# EAGLE design panel (EAGLE 7.2.0)
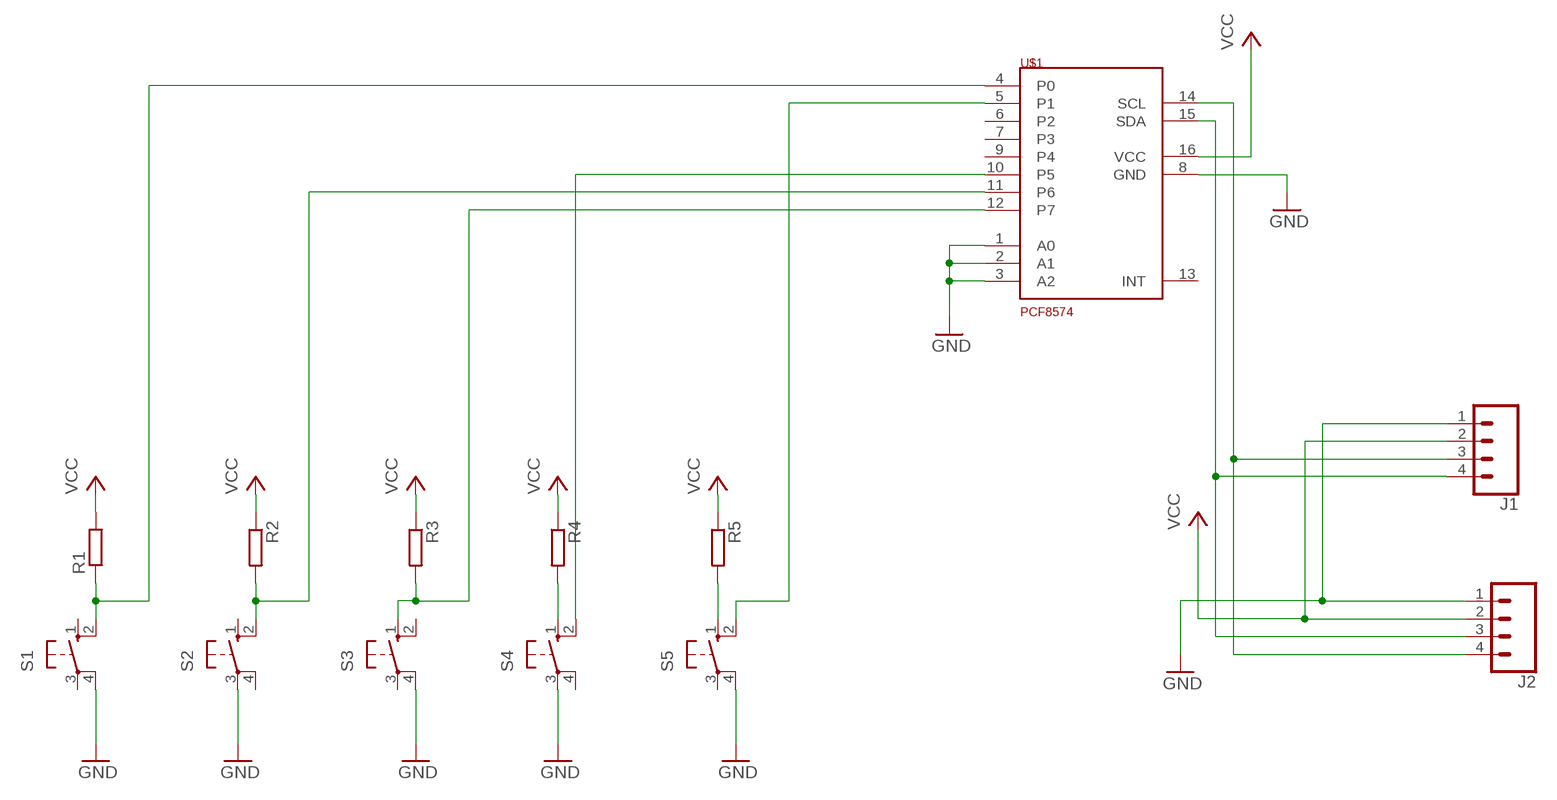
[diagram p0: schematic, sheet 1]

## Parts
J1  CONN_04PTH  [1X04]
J2  CONN_04PTH  [1X04]
R1  R-EU_0204/7  [0204/7]
R2  R-EU_0204/7  [0204/7]
R3  R-EU_0204/7  [0204/7]
R4  R-EU_0204/7  [0204/7]
R5  R-EU_0204/7  [0204/7]
S1  10-XX  [B3F-10XX]
S2  10-XX  [B3F-10XX]
S3  10-XX  [B3F-10XX]
S4  10-XX  [B3F-10XX]
S5  10-XX  [B3F-10XX]
U$1  PCF8574  [SO16(SW)]

## Nets
B0: R1.1 S1.2(S1) U$1.4(P0)
B1: R2.2 S2.2(S1) U$1.11(P6)
B2: R3.2 S3.1(S) U$1.12(P7)
B3: S4.2(S1) U$1.10(P5)
B4: S5.2(S1) U$1.5(P1)
GND: J1.1 J2.1 S1.4(P1) S2.3(P) S3.4(P1) S4.3(P) S5.4(P1) U$1.1(A0) U$1.2(A1) U$1.3(A2) U$1.8(GND)
N$1: R5.2 S5.1(S)
N$2: R4.2 S4.1(S)
N$4: J1.4 J2.3 U$1.15(SDA)
N$5: J1.3 J2.4 U$1.14(SCL)
VCC: J1.2 J2.2 R1.2 R2.1 R3.1 R4.1 R5.1 U$1.16(VCC)
Unconnected: S1.1(S) S1.3(P) S2.1(S) S2.4(P1) S3.2(S1) S3.3(P) S4.4(P1) S5.3(P) U$1.6(P2) U$1.7(P3) U$1.9(P4) U$1.13(INT)

## Library data of the parts
J1 J2 = SparkFun-Connectors:CONN_04: Multi connection point. Often used as Generic Header-pin footprint for 0.1 inch spaced/style header connections On any of the 0.1 inch spaced packages, you can populate with these: Break Away Headers - Straight <https://www.sparkfun.com/products/116> (PRT-00116) Break Away Male Headers - Right Angle <https://www.sparkfun.com/products/553> (PRT-00553) Female Headers <https://www.sparkfun.com/products/115> (PRT-00115) Break Away Headers - Machine Pin <https://www.sparkfun.com/products/117> (PRT-00117) Break Away Female Headers - Swiss Machine Pin <https://www.sparkfun.com/products/743> (PRT-00743) For SCREWTERMINALS and SPRING TERMINALS visit here: Screw Terimnals on SparkFun.com <https://www.sparkfun.com/search/results?term=Screw+Terminals> (5mm/3.5mm/2.54mm spacing) This device is also useful as a general connection point to wire up your design to another part of your project. Our various solder wires solder well into these plated through hole pads. Hook-Up Wire - Assortment (Stranded, 22 AWG) <https://www.sparkfun.com/products/11375> (PRT-11375) Hook-Up Wire - Assortment (Solid Core, 22 AWG) <https://www.sparkfun.com/products/11367> (PRT-11367) View the entire wire category on our website here <https://www.sparkfun.com/categories/141> Special notes: Molex polarized connector foot print use with SKU : PRT-08231 with associated crimp pins and housings. 1MM SMD Version SKU: PRT-10208; PROD_ID: CONN-09696
R1-R5 = resistor:R-EU_: RESISTOR, European symbol
S1-S5 = switch-omron:10-XX: OMRON SWITCH; MPN: B3F-1000; OC_FARNELL: 176432; OC_NEWARK: 36M3542
U$1 = pcf8574p:PCF8574

## Net classes
0 default: clearance 0.205 mm

## Board
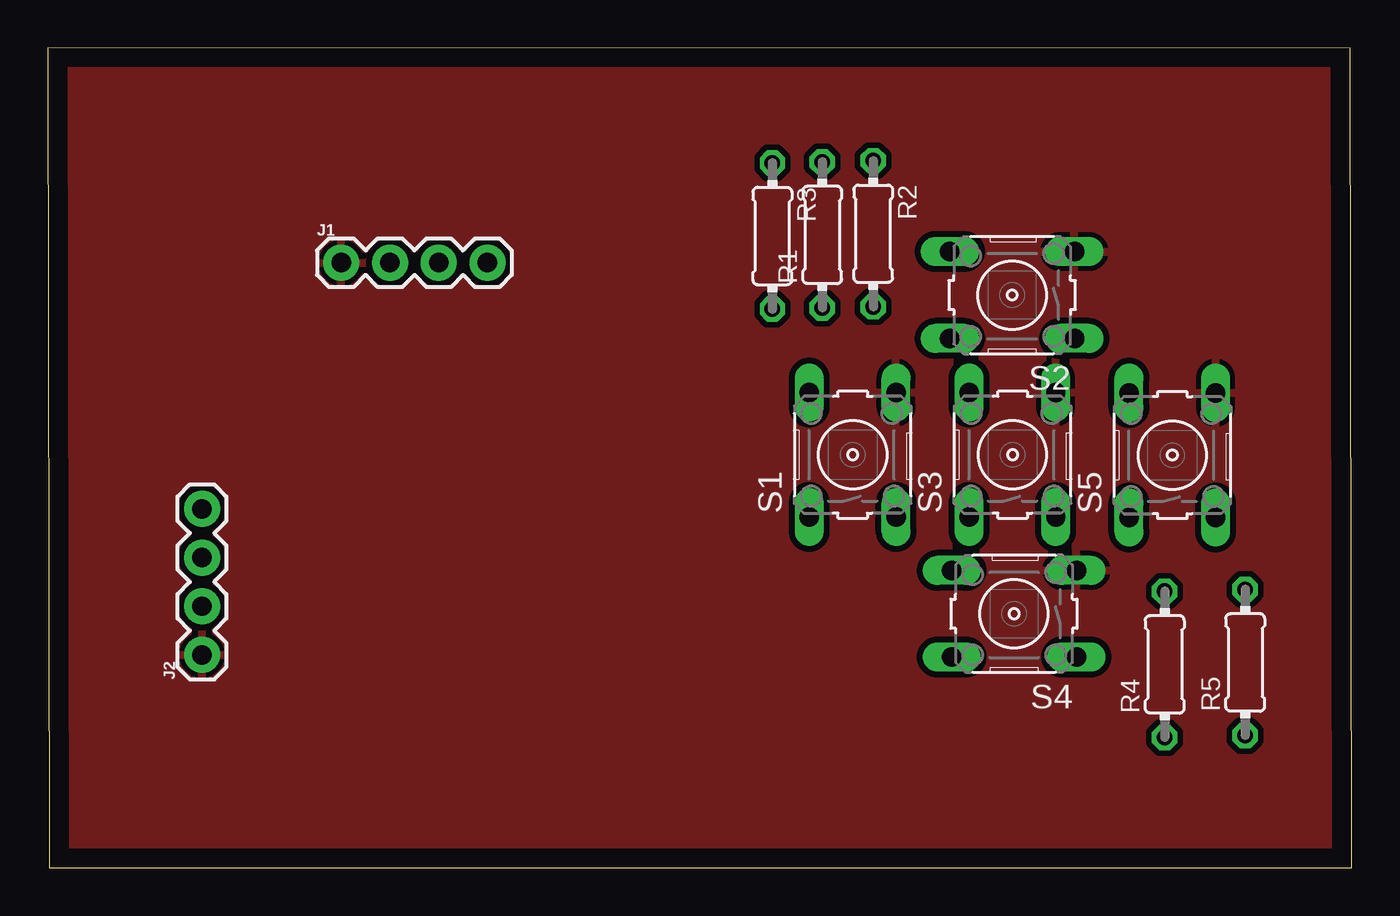
[diagram p1: board, top side]
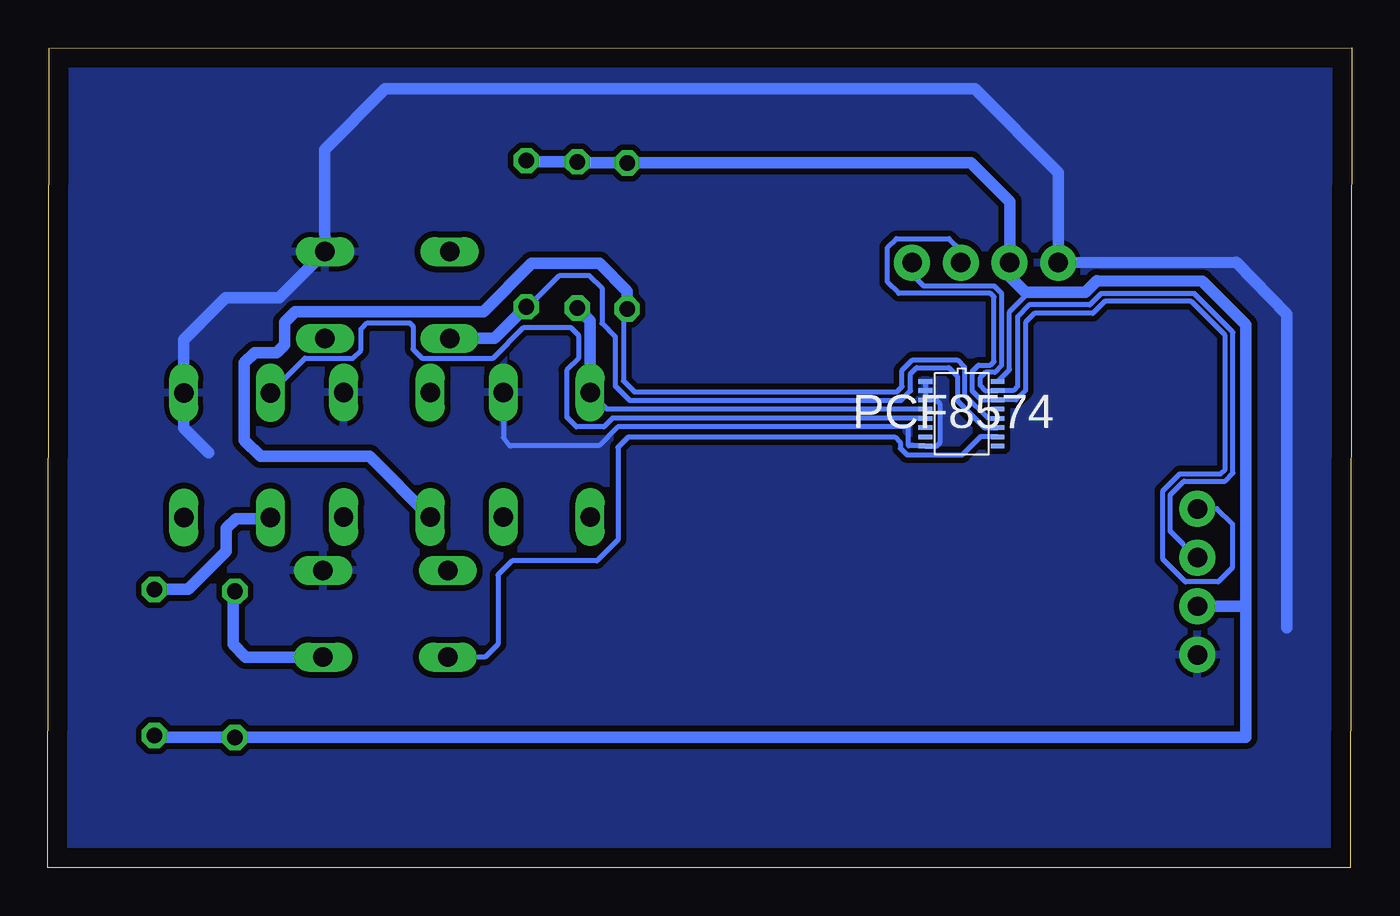
[diagram p2: board, bottom side, seen from below]

Size 68.02 x 42.76 mm. Coordinates in mm from the lower left corner, seen from the top.
Outline: 0.07,0 68.02,0.01 67.96,42.75 0,42.76 0.07,0
Copper layers (1*16): Top 0.035mm / dielectric 1.5mm / Bottom 0.035mm
Design rules "panel *": minimum track width 20mil, minimum drill 40mil, track to track 0.205mm, track to pad 0.205mm, pad to pad 0.205mm, via to via 0.205mm, smd to smd 8mil, copper to edge 40mil, drill to drill 8mil, minimum pad ring 10mil, minimum via ring 8mil, stop-mask expansion 4mil, vias tented up to drill 0mil, thermal gap 10mil

### Footprints (pad centres in the part's own frame; a part is rotated, then mirrored left to right if it is on the bottom)
1X04 = drill 1.016 pad 1.88: 1 0,0; 2 2.54,0; 3 5.08,0; 4 7.62,0
0204/7 = drill 0.813 octagon: 1 -3.81,0; 2 3.81,0
B3F-10XX = drill 1.016 long: 1 -3.251,2.261; 2 3.251,2.261; 3 -3.251,-2.261; 4 3.251,-2.261
SO16(SW) = smd 0.716 x 0.232: 1 -1.887,1.694; 2 -1.887,1.21; 3 -1.887,0.726; 4 -1.887,0.242; 5 -1.887,-0.242; 6 -1.887,-0.726; 7 -1.887,-1.21; 8 -1.887,-1.694; 9 1.887,-1.694; 10 1.887,-1.21; 11 1.887,-0.726; 12 1.887,-0.242; 13 1.887,0.242; 14 1.887,0.726; 15 1.887,1.21; 16 1.887,1.694

### Placement (x,y rotation side)
J1  15.31,31.56 0 top
J2  8.04,11.1 90 top
R1  40.4,33.01 90 top
R2  43.06,33.07 270 top
R3  37.8,32.95 270 top
R4  58.27,10.61 90 top
R5  62.47,10.71 90 top
S1  41.99,21.54 90 top
S2  50.31,29.87 180 top
S3  50.33,21.54 90 top
S4  50.41,13.25 180 top
S5  58.67,21.52 90 top
U$1  20.35,23.68 0 bottom

### Tracks (layer width: path | path; a pad name or v marks a point on that pad's centre or on a via)
B0
  Bottom 0.254: U$1.4 38.86,23.92 S1.2
  Bottom 0.61: S1.2 39.73,28.53 R1.1
B1
  Bottom 0.254: R2.2 42.96,29.26 41.32,30.9 39.78,30.9 39.12,30.24 39.12,28.39 38.43,27.7 38.43,25.14 37.67,24.38 23.5,24.38 23.01,24.87 23.01,25.77 22.7,26.08 21.02,26.08 20.57,25.63 20.57,24.37 19.16,22.96 U$1.11
  Bottom 0.61: S2.2 44.71,27.61 R2.2
B2
  Bottom 0.254: U$1.12 18.95,23.44 20.19,24.68 20.19,26.11 20.57,26.49 22.91,26.49 23.46,25.94 23.46,25.09 23.73,24.82 37.42,24.82 38,25.4 38,28.94 R3.2
  Bottom 0.61: R3.2 37.8,30.08 39.24,31.52 42.78,31.52 45.3,29 55.12,29 55.68,28.44 55.68,27.27 56.09,26.86 57.24,26.86 57.77,26.33 57.77,22.3 56.93,21.46 51.24,21.46 S3.1
B3
  Bottom 0.254: U$1.10 19.37,22.47 20.31,21.53 23.19,21.53 23.54,21.88 23.54,22.18 23.83,22.47 37.73,22.47 38.28,21.92 38.28,17.1 39.37,16.01 43.8,16.01 44.54,15.27 44.54,11.67 45.22,10.99 S4.2
B4
  Bottom 0.254: S5.2 54.6,26.58 54.59,26.57 52.11,26.57 51.68,27 51.68,28.1 51.36,28.42 49.14,28.42 48.97,28.25 48.97,27.05 48.5,26.58 44.79,26.58 43.19,28.18 40.74,28.18 40.34,27.78 40.34,26.55 40.95,25.94 40.94,25.93 40.94,23.5 40.44,23 39.01,23 38.54,23.47 22.27,23.47 U$1.5
GND
  Bottom 0.254: S1.4 44.25,22.43 43.92,22 43.83,22.01 43.82,22.02 39.27,22.02 38.29,23 23.11,23 23.11,22 22.25,22 U$1.8 21.67,21.99 21.46,22.2 21.46,24.17 21.69,24.4 U$1.3 U$1.2 U$1.1 22.24,25.2
  Bottom 0.61: 3.37,12.53 3.37,28.87 6.02,31.57 J1.1 15.29,36.26 19.65,40.62 50.42,40.62 53.58,37.46 53.58,33.83 S2.3 55.95,29.74 58.74,29.74 60.93,27.55 S5.4 60.93,22.94 59.64,21.65
  pour Bottom (isolate 0.305): 0.2,42.57 67.89,42.58 67.97,0.18 0,0.14
  pour Top (isolate 0.305): 0.2,42.58 67.84,42.64 67.91,0 0.07,0
N$1
  Bottom 0.61: R5.2 60.71,14.52 58.71,16.52 58.71,17.7 58.21,18.2 56.48,18.2 S5.1
N$2
  Bottom 0.61: S4.1 57.69,10.99 58.36,11.66 58.36,14.33 R4.2
N$4
  Bottom 0.254: J2.3 8.07,16.15 9.47,17.55 9.47,19.45 8.75,20.17 6.6,20.17 6.19,20.58 6.19,27.93 8.2,29.94 13.08,29.94 13.66,29.36 16.83,29.36 17.43,28.75 17.43,25.11 17.65,24.89 U$1.15 | J1.4 22.93,30.95 22.33,30.35 18.65,30.35 18.26,29.96 18.26,26.2 18.62,25.84 19.1,25.84 19.39,25.55 19.39,25.16 19.12,24.89 U$1.15 | U$1.15
N$5
  Bottom 0.254: J2.4 7.02,18.73 6.22,17.93 6.23,15.64 6.96,14.91 8.67,14.91 9.84,16.08 9.84,19.67 8.97,20.54 6.84,20.54 6.6,20.78 6.6,27.77 8.37,29.54 12.88,29.54 13.5,28.92 16.54,28.92 17.01,28.45 17.01,24.89 17.51,24.4 U$1.14 19.34,24.41 19.79,24.86 19.79,25.89 19.47,26.21 18.85,26.21 18.66,26.4 18.66,29.78 18.84,29.96 23.63,29.96 24.21,30.54 24.21,32.36 23.75,32.82 21,32.82 20.39,32.21 J1.3
VCC
  Bottom 0.254: U$1.16 17.85,25.99 17.85,28.99 16.83,30.01
  Bottom 0.61: R2.1 43,36.82 R1.2 40.34,36.76 R3.1 19.86,36.76 17.84,34.74 J1.2 17.85,30.85 17.01,30.01 16.83,30.01 13.89,30.01 13.29,30.61 7.8,30.6 5.53,28.33 5.52,15.2 5.52,13.7 5.52,13.64 | R5.1 62.37,6.8 R4.1 5.52,6.8 5.52,13.64 | J2.2 5.52,13.64